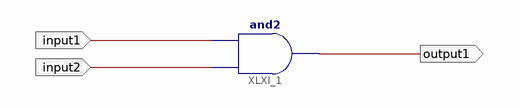
[diagram p0: schematic sheet 1]
// Xilinx ISE schematic andcirkt.sch (spartan6) as structural Verilog: 1 symbols, 3 ports
module andcirkt (
  input  input1,
  input  input2,
  output output1
);

  and XLXI_1 (output1, input2, input1);
endmodule
